# Altium schematic sheet ttl.SchDoc
size 209 x 297 mm; SheetNumber: 1; SheetTotal: 2
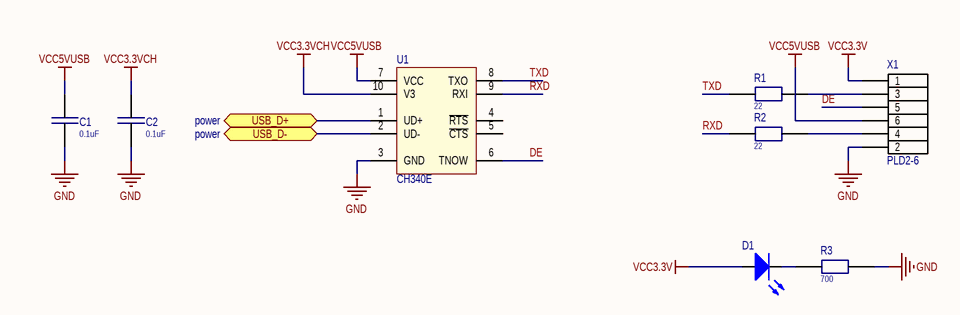
[diagram p0: ttl.SchDoc]

## Parts
C1  0.1uF  [C_0603]
C2  0.1uF  [C_0603]
D1  RED  [LED_0603]  (value not drawn)
R1  22  [R_0603]
R2  22  [R_0603]
R3  700  [R_0603]
U1  CH340E  [MSOP10]
X1  PLD2-6  [PLD-6-sideways]  (net tie, no BOM)

## Ports
USB_D+ (bidir, see power), USB_D- (bidir, see power)

## Nets
GND: C1.1 C2.1 R3.1 U1.3(GND) X1.2
VCC3.3V: D1.1(A) X1.1
VCC3.3VCH: C2.2 U1.10(V3)
VCC5VUSB: C1.2 U1.7(VCC) X1.6
DE: U1.6(TNOW) X1.5
RXD: R2.2 U1.9(RXI)
TXD: R1.2 U1.8(TXO)
USB_D+: U1.1(UD+) ; port USB_D+
USB_D-: U1.2(UD-) ; port USB_D-
NetD1_2: D1.2(K) R3.2
NetR1_1: R1.1 X1.3
NetR2_1: R2.1 X1.4

Not connected (* = marked no-connect by the designer): U1 4(~{RTS}) 5(~{CTS})

## Library data of the parts
C1 C2 = CAP_SMD: Capacitor; Part Number: CC0603KPX7R9BB104; Alternative Part: *; Value: 0.1uF
D1 = LED_SMT_0603: LED; Part Number: GNL-0603SRC; Value: *; Color: RED
R1 R2 = RES_SMD: Resistor; Part Number: RC0603FR-0722RL; Alternative Part: *; Value: 22
R3 = RES_SMD: Resistor; Part Number: RC0603FR-07750RL; Alternative Part: *; Value: 700
U1 = CH340E: USB to serial chip CH340; MF: WCH; SnapEDA_Link: https://www.snapeda.com/parts/CH340E/WCH/view-part/?ref=snap; Package: Package; Value: *; Part Number: CH340E; Check_prices: https://www.snapeda.com/parts/CH340E/WCH/view-part/?ref=eda
X1 = PLD2-6: Header, 6-Pin, Dual row